# Altium schematic sheet 更改记录.SchDoc
size A4
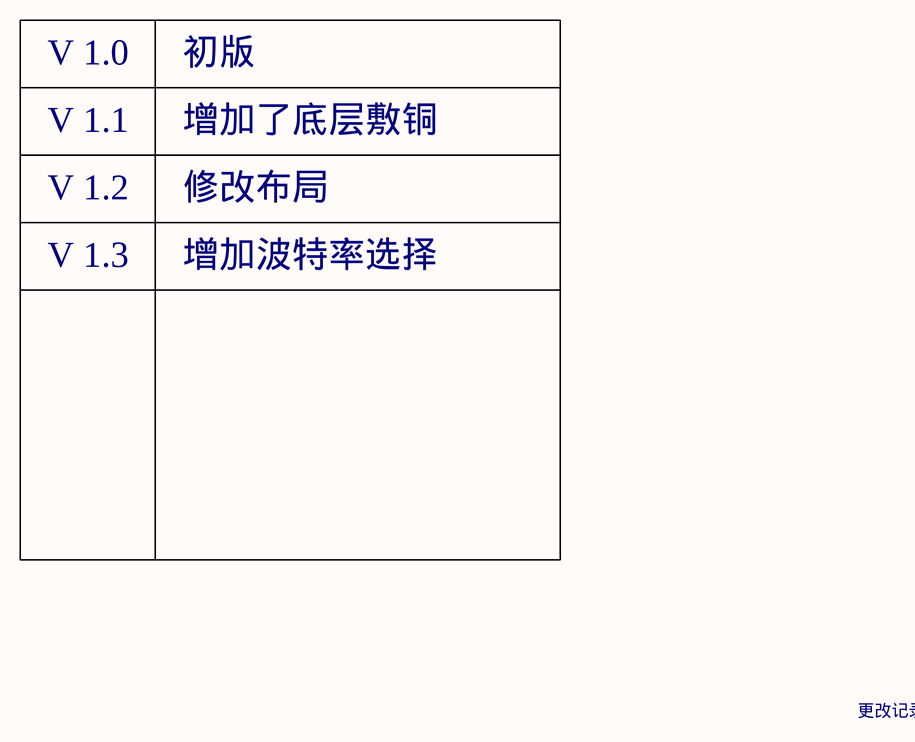
[diagram p0: 更改记录.SchDoc]

## Notes on the sheet
- V 1.0
- 初版
- V 1.1
- 增加了底层敷铜
- V 1.2
- 修改布局
- V 1.3
- 增加波特率选择
- 更改记录